# Altium schematic sheet I2C-RTC.SchDoc: =ProjectTitle
size 209 x 297 mm; Scale: 1:1; Address1: Address1; Address2: Address2; Address3: Address3; Address4: Address4; SheetNumber: 4; SheetTotal: 9; DocumentType: Схема электрическая принципиальная
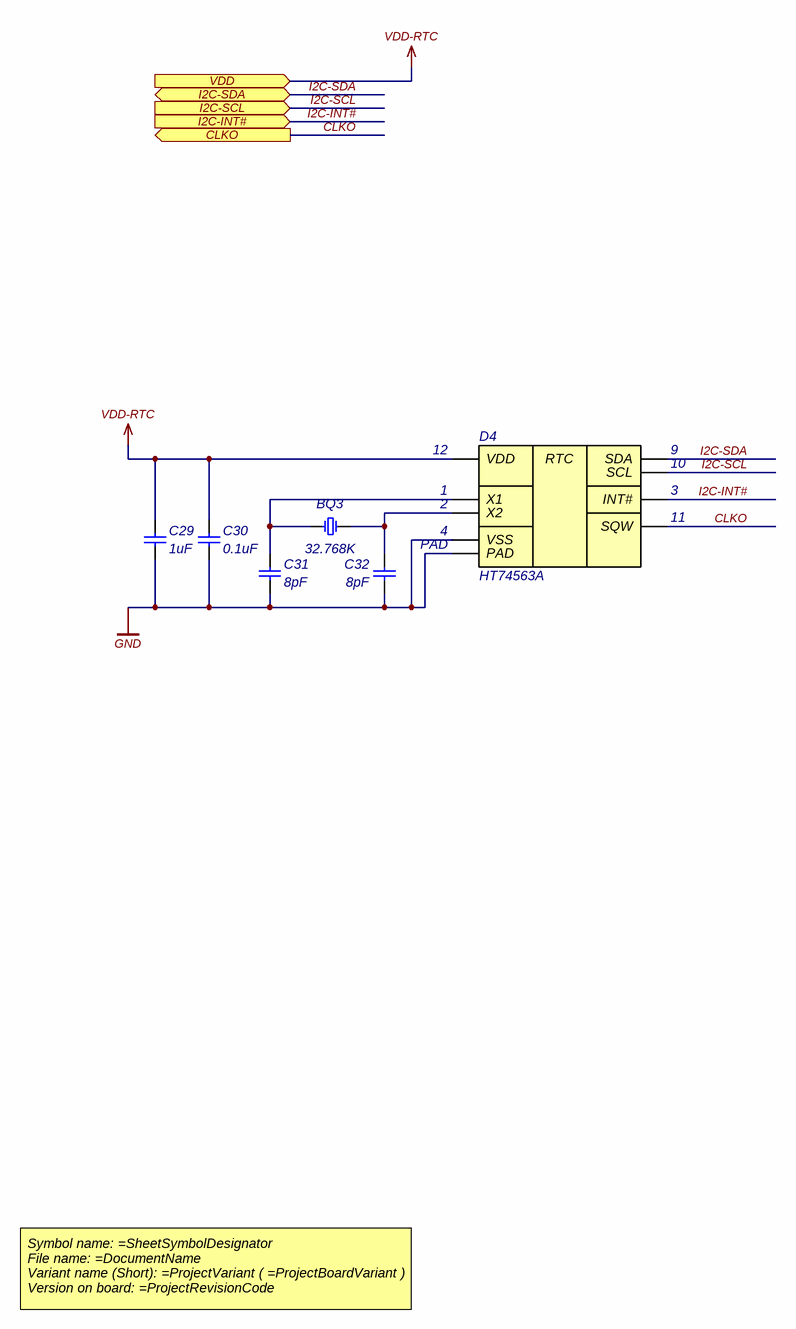
[diagram p0: I2C-RTC.SchDoc]

## Parts
BQ3  32.768K  [SMD1610-2]
C29  1uF  [C0402]
C30  0.1uF  [C0402]
C31  8pF  [C0402]
C32  8pF  [C0402]
D4  HT74563A  [QFN16-3X3P0.5-4X4PAD]

## Ports
CLKO (out), I2C-INT# (in), I2C-SCL (in), I2C-SDA (bidir), VDD (in)

## Nets
GND: C29.2 C30.2 C31.2 C32.2 D4.4(VSS) D4.PAD
VDD-RTC: C29.1 C30.1 D4.12(VDD) ; port VDD
CLKO: D4.11(SQW) ; port CLKO
I2C-INT#: D4.3(INT#) ; port I2C-INT#
I2C-SCL: D4.10(SCL) ; port I2C-SCL
I2C-SDA: D4.9(SDA) ; port I2C-SDA
NetBQ3_1: BQ3.1(inp) C31.1 D4.1(X1)
NetBQ3_2: BQ3.2(out) C32.1 D4.2(X2)

## Notes on the sheet
- Symbol name: =SheetSymbolDesignator
  File name: =DocumentName
  Variant name (Short): =ProjectVariant ( =ProjectBoardVariant )
  Version on board: =ProjectRevisionCode
- Подп. и дата
- Инв. № дубл.
- Взам. инв. №
- Инв. № подл.
- Изм.
- Лист
- № докум.
- Подп.
- Дата
- 2.106-A4
- Копировал
- Формат А4
- (in symbol HT74563A) RTC

## Library data of the parts
BQ3 = SMD1610-32.768K-12.5pF-20ppm: 32.768kHz 12.5pF ±20ppm SMD1610-2PCrystal; Manufacturer: Seiko Epson / Seiko Epson; NameFromManufacturer: X1A0001210005; Place: T; Check: False; Part Number: SMD1610-32.768K-12.5pF-20ppm; Value: 32.768K; Temperature: -40°C~85°C; Tolerance: 20ppm; ComponentLink1Description: DATASHEET; ComponentLink1URL: https://www.lcsc.com/product-detail/SMD-Crystal-Resonators_Seiko-Epson_X1A0001210005_Seiko-Epson-X1A0001210005_C165064.html; Last changed: 04.03.2024
C29 = 0402-X5R-10V-1uF±10%: Manufacturer: Samsung; NameFromManufacturer: CL05A105KP5NNNC; Place: S; Voltage: 10V; Tolerance: 10%; Check: False; Part Number: 0402-X5R-10V-1uF±10%; Value: 1uF; Temperature: -55°C~85°C; ComponentLink2Description: Link to datasheet; ComponentLink1Description: DATASHEET; ComponentLink2URL: https://datasheet.ciiva.com/15195/getdatasheetpartid-358390-15195630.pdf?src-supplier=Verical; ComponentLink1URL: Datasheets/capacitors/getdatasheetpartid-358390-15195630.pdf; Last changed: 27.10.2022
C30 = 0402-X7R-16V-0.1uF±10%: Manufacturer: Yageo; NameFromManufacturer: CC0402JRX7R7BB104; Place: S; Voltage: 16V; Tolerance: 10%; Check: False; Part Number: 0402-X7R-16V-0.1uF±10%; Value: 0.1uF; Temperature: -55°C~125°C; ComponentLink2Description: Link to datasheet; ComponentLink1Description: DATASHEET; ComponentLink2URL: https://www.yageo.com/upload/media/product/productsearch/datasheet/mlcc/UPY-GPHC_X7R_6.3V-to-50V_18.pdf; ComponentLink1URL: Datasheets/capacitors/UPY-GPHC_X7R_6.3V-to-50V_18.pdf; Last changed: 27.10.2022
C31 C32 = 0402-NP0-50V-8pF±0.25pF: Manufacturer: Yageo; NameFromManufacturer: CC0402CRNPO9BN8R0; Place: S; Voltage: 50V; Tolerance: 0.25pF; Check: False; Part Number: 0402-NP0-50V-8pF±0.25pF; Value: 8pF; Temperature: -55°C~125°C; ComponentLink2Description: Link to datasheet; ComponentLink1Description: DATASHEET; ComponentLink2URL: https://www.yageo.com/upload/media/product/productsearch/datasheet/mlcc/UPY-GP_NP0_16V-to-50V_18.pdf; ComponentLink1URL: Datasheets/capacitors/UPY-GP_NP0_16V-to-50V_18.pdf; Last changed: 27.10.2022
D4 = HT74563A: RTC Clock QFN-16; Manufacturer: HTCSEMI; NameFromManufacturer: HT74563ARQZ; Place: T; Check: False; Part Number: HT74563A; Temperature: -40°C~85°C; Value: HT74563A; ComponentLink1Description: DATASHEET; ComponentLink1URL: https://www.lcsc.com/product-detail/Real-time-Clocks-RTC_HTCSEMI-HT74563ARQZ_C3019559.html; Last changed: 21.01.2024